# Altium schematic sheet Docking Station.SchDoc
size A4
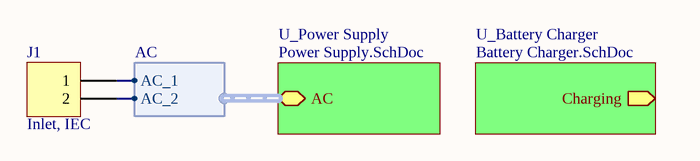
[diagram p0: Docking Station.SchDoc]

## Parts
J1  Inlet, IEC  [Inlet, IEC - Plug]

## Sub-sheets
U_Battery Charger = Battery Charger.SchDoc: Charging (out)
U_Power Supply = Power Supply.SchDoc: AC (harness AC)

## Harnesses
AC: AC_1, AC_2

## Nets
NetJ1_1: J1.1 ; sheet U_Power Supply/AC.AC_1
NetJ1_2: J1.2 ; sheet U_Power Supply/AC.AC_2

## Library data of the parts
J1 = Inlet, IEC - Plug